# Altium schematic sheet CMTopLevel.SchDoc
size Letter
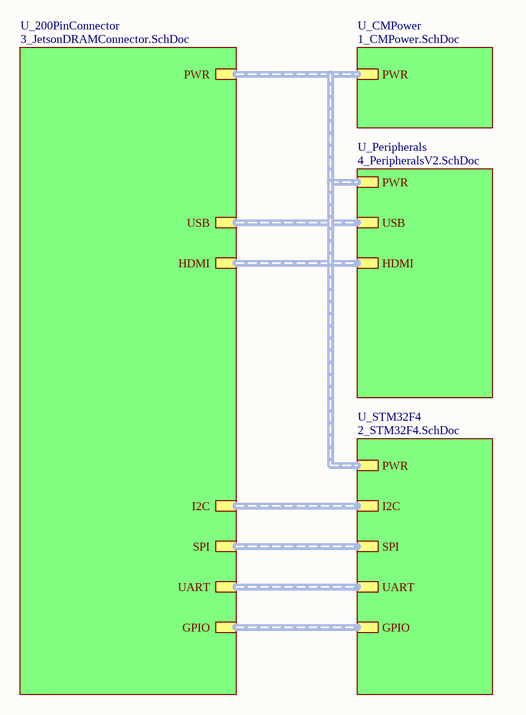
[diagram p0: CMTopLevel.SchDoc]

## Sub-sheets
U_200PinConnector = 3_JetsonDRAMConnector.SchDoc: PWR (harness SODIMM_MO-224_POWER), USB (harness SODIMM_MO-224_POWER), HDMI (harness SODIMM_MO-224_POWER), I2C (harness SODIMM_MO-224_POWER), SPI (harness SODIMM_MO-224_POWER), UART (harness SODIMM_MO-224_POWER), GPIO (harness SODIMM_MO-224_POWER)
U_CMPower = 1_CMPower.SchDoc: PWR (harness SODIMM_MO-224_POWER)
U_Peripherals = 4_PeripheralsV2.SchDoc: USB (harness SODIMM_MO-224_POWER), HDMI (harness SODIMM_MO-224_POWER), PWR (harness SODIMM_MO-224_POWER)
U_STM32F4 = 2_STM32F4.SchDoc: PWR (harness SODIMM_MO-224_POWER), I2C (harness SODIMM_MO-224_POWER), UART (harness SODIMM_MO-224_POWER), SPI (harness SODIMM_MO-224_POWER), GPIO (harness SODIMM_MO-224_POWER)

## Buses and harness runs
harness sheet U_200PinConnector/GPIO = sheet U_STM32F4/GPIO
harness sheet U_200PinConnector/HDMI = sheet U_Peripherals/HDMI
harness sheet U_200PinConnector/I2C = sheet U_STM32F4/I2C
harness sheet U_200PinConnector/PWR = sheet U_CMPower/PWR = sheet U_Peripherals/PWR = sheet U_STM32F4/PWR
harness sheet U_200PinConnector/SPI = sheet U_STM32F4/SPI
harness sheet U_200PinConnector/UART = sheet U_STM32F4/UART
harness sheet U_200PinConnector/USB = sheet U_Peripherals/USB